# Altium schematic sheet bai 3.SchDoc
size A
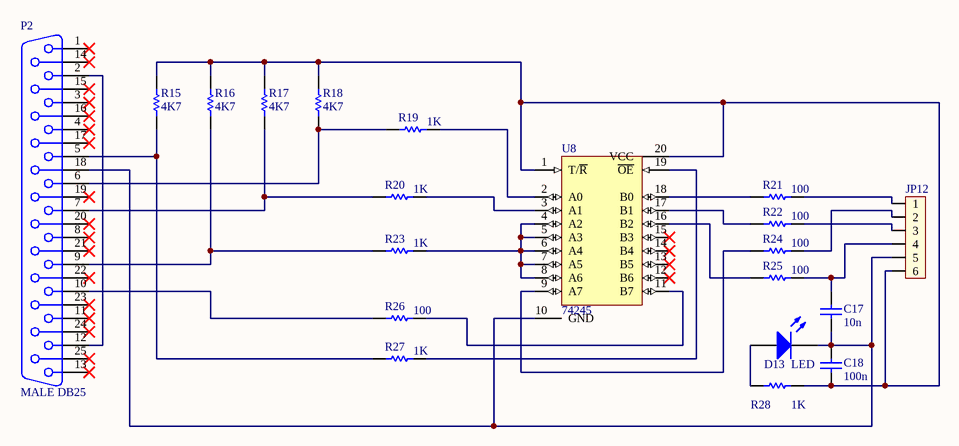
[diagram p0: bai 3.SchDoc]

## Parts
C17  value 10n  [RAD-0.3]  (hidden comment: Cap)
C18  value 100n  [RAD-0.3]  (hidden comment: Cap)
D13  LED  [LED-1]
JP12  JP6 PIN  [JP6]  (value not drawn)
P2  MALE DB25  [DSB 25-F]
R15  value 4K7  [R1/4W]  (hidden comment: Res1)
R16  value 4K7  [R1/4W]  (hidden comment: Res1)
R17  value 4K7  [R1/4W]  (hidden comment: Res1)
R18  value 4K7  [R1/4W]  (hidden comment: Res1)
R19  value 1K  [R1/4W]  (hidden comment: Res1)
R20  value 1K  [R1/4W]  (hidden comment: Res1)
R21  value 100  [R1/4W1]  (hidden comment: Res1)
R22  value 100  [R1/4W1]  (hidden comment: Res1)
R23  value 1K  [R1/4W]  (hidden comment: Res1)
R24  value 100  [R1/4W1]  (hidden comment: Res1)
R25  value 100  [R1/4W1]  (hidden comment: Res1)
R26  value 100  [R1/4W1]  (hidden comment: Res1)
R27  value 1K  [R1/4W]  (hidden comment: Res1)
R28  value 1K  [R1/4W]  (hidden comment: Res1)
U8  74245  [DIP20/W0.3]

## Nets
GND: C17.1 C18.2 D13.2(K) JP12.5 P2.18 U8.10(GND)
VCC: C18.1 JP12.6 R15.2 R16.2 R17.2 R18.2 R28.1 U8.1(T/~{R}) U8.20(VCC)
NetC17_2: C17.2 JP12.4 R25.1
NetD13_1: D13.1(A) R28.2
NetJP12_1: JP12.1 R21.1
NetJP12_2: JP12.2 R24.1
NetJP12_3: JP12.3 R22.1
NetP2_2: P2.2 P2.12
NetP2_5: P2.5 R15.1 R27.2
NetP2_6: P2.6 R18.1 R19.2
NetP2_7: P2.7 R17.1 R20.2
NetP2_9: P2.9 R16.1 R23.2
NetP2_10: P2.10 R26.2
NetR19_1: R19.1 U8.2(A0)
NetR20_1: R20.1 U8.3(A1)
NetR21_2: R21.2 U8.18(B0)
NetR22_2: R22.2 U8.17(B1)
NetR23_1: R23.1 U8.4(A2) U8.5(A3) U8.6(A4) U8.7(A5) U8.8(A6)
NetR24_2: R24.2 U8.9(A7)
NetR25_2: R25.2 U8.16(B2)
NetR26_1: R26.1 U8.11(B7)
NetR27_1: R27.1 U8.19(~{OE})

Not connected (* = marked no-connect by the designer): P2 1* 3* 4* 8* 11* 13* 14* 15* 16* 17* 19* 20* 21* 22* 23* 24* 25* 26(MH1) 27(MH2); U8 12(B6)* 13(B5)* 14(B4)* 15(B3)*

## Library data of the parts
C17 C18 = Cap: Capacitor; Published: 8-Jun-2000; LatestRevisionDate: 17-Jul-2002; LatestRevisionNote: Re-released for DXP Platform.; PackageReference: RAD-0.3; Publisher: Altium Limited; PackageDescription: Radial Cap, Thru-Hole; 2 Leads; 0.3 in Pin Spacing
D13 = LED1: Typical RED GaAs LED; Published: 8-Jun-2000; LatestRevisionDate: 08-Jul-2005; LatestRevisionNote: Mech Layer 1 removed.; PackageReference: LED-1; Publisher: Altium Limited; PackageDescription: LED; 2 Leads
JP12 = JP6: Value: JP7
P2 = DSB 25: LPT 25; PackageDocument: U; Positions: 25; Gender: Receptacle; Value: LPT 25; Published: 15-Jun-2001; LatestRevisionDate: 17-Jul-2002; LatestRevisionNote: Re-released for DXP Platform.; DatasheetDocument: 19-Mar-1999; PackageReference: 787202; Publisher: Altium Limited; Orientation: Right Angle
R15-R20 R23 R27 R28 = Res1_1: Resistor; Manufacturer: Generic Components; Class: Passive; Published: 08/06/2000; Publisher: Altium Hobart Technology Centre; SubClass: Resistor
R21 R22 R24-R26 = Res1_5: Resistor; Manufacturer: Generic Components; Class: Passive; Published: 08/06/2000; Publisher: Altium Hobart Technology Centre; SubClass: Resistor
U8 = 74245: Octal bus tranceiver; 3-state; Copyright by: VanDungEvn@gmail.com